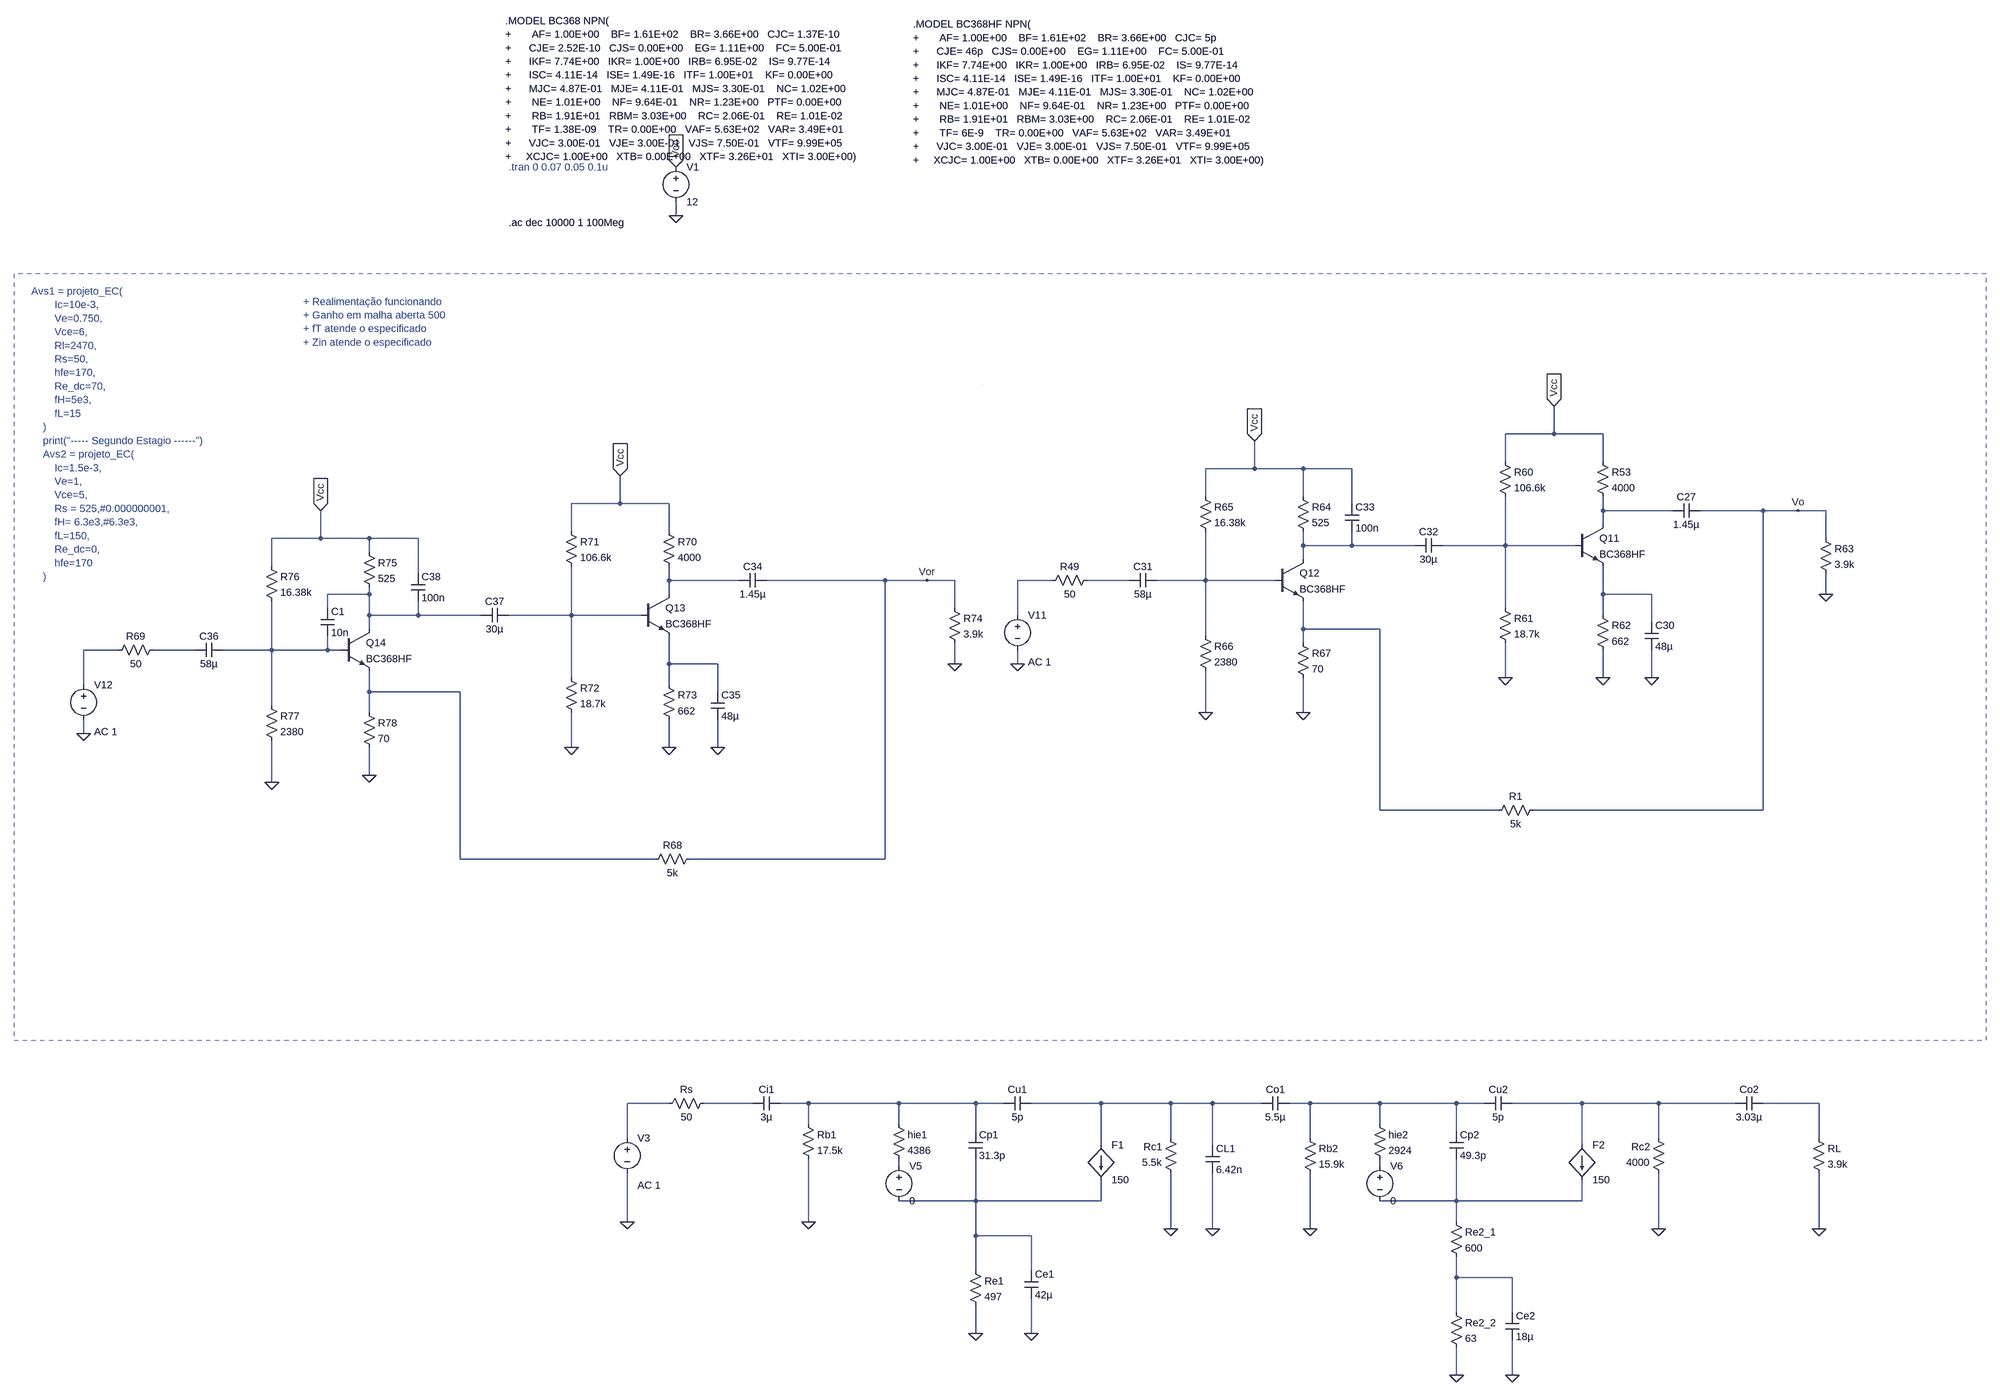
[diagram p0: schematic Simulacao.asc]
Simulacao.asc, the LTspice schematic file:
Version 4.1
SHEET 1 6724 3060
WIRE -704 -704 -704 -736
WIRE 1312 112 1312 48
WIRE 1312 112 1200 112
WIRE 1424 112 1312 112
WIRE 1200 176 1200 112
WIRE 1424 176 1424 112
WIRE 624 192 624 128
WIRE 624 192 512 192
WIRE 736 192 624 192
WIRE 848 192 736 192
WIRE 512 256 512 192
WIRE 736 256 736 192
WIRE -832 272 -832 208
WIRE -832 272 -944 272
WIRE -720 272 -832 272
WIRE 848 272 848 192
WIRE 1424 288 1424 256
WIRE 1584 288 1424 288
WIRE 1792 288 1648 288
WIRE 1872 288 1792 288
WIRE 1936 288 1872 288
WIRE 1424 320 1424 288
WIRE -944 336 -944 272
WIRE -720 336 -720 272
WIRE -1520 352 -1520 288
WIRE -1520 352 -1632 352
WIRE -1408 352 -1520 352
WIRE -1296 352 -1408 352
WIRE 1936 352 1936 288
WIRE 736 368 736 336
WIRE 848 368 848 336
WIRE 848 368 736 368
WIRE 992 368 848 368
WIRE 1200 368 1200 256
WIRE 1200 368 1056 368
WIRE 1360 368 1200 368
WIRE -1408 384 -1408 352
WIRE 736 400 736 368
WIRE -1632 416 -1632 352
WIRE -1296 432 -1296 352
WIRE -720 448 -720 416
WIRE -560 448 -720 448
WIRE -224 448 -496 448
WIRE -128 448 -224 448
WIRE -64 448 -128 448
WIRE 160 448 80 448
WIRE 336 448 240 448
WIRE 512 448 512 336
WIRE 512 448 400 448
WIRE 672 448 512 448
WIRE -1408 480 -1408 464
WIRE -1408 480 -1504 480
WIRE -720 480 -720 448
WIRE 1424 480 1424 416
WIRE 1536 480 1424 480
WIRE 1936 480 1936 432
WIRE -1504 512 -1504 480
WIRE -64 512 -64 448
WIRE 1200 512 1200 368
WIRE -1408 528 -1408 480
WIRE -1296 528 -1296 496
WIRE -1296 528 -1408 528
WIRE -1152 528 -1296 528
WIRE -944 528 -944 416
WIRE -944 528 -1088 528
WIRE -784 528 -944 528
WIRE 80 528 80 448
WIRE 1424 528 1424 480
WIRE 1536 544 1536 480
WIRE -1408 560 -1408 528
WIRE 736 560 736 496
WIRE 912 560 736 560
WIRE 512 576 512 448
WIRE 736 592 736 560
WIRE -1984 608 -2064 608
WIRE -1808 608 -1904 608
WIRE -1632 608 -1632 496
WIRE -1632 608 -1744 608
WIRE -1504 608 -1504 576
WIRE -1504 608 -1632 608
WIRE -1472 608 -1504 608
WIRE -720 640 -720 576
WIRE -608 640 -720 640
WIRE -64 640 -64 592
WIRE 80 640 80 608
WIRE -944 672 -944 528
WIRE 1200 672 1200 592
WIRE 1424 672 1424 608
WIRE 1536 672 1536 608
WIRE -2064 688 -2064 608
WIRE -720 688 -720 640
WIRE -1408 704 -1408 656
WIRE -1200 704 -1408 704
WIRE -608 704 -608 640
WIRE -1632 736 -1632 608
WIRE -1408 752 -1408 704
WIRE 512 752 512 656
WIRE 736 752 736 672
WIRE -2064 800 -2064 768
WIRE -944 832 -944 752
WIRE -720 832 -720 768
WIRE -608 832 -608 768
WIRE -1408 896 -1408 832
WIRE -1632 912 -1632 816
WIRE 912 976 912 560
WIRE 1184 976 912 976
WIRE 1792 976 1792 288
WIRE 1792 976 1264 976
WIRE -1200 1088 -1200 704
WIRE -752 1088 -1200 1088
WIRE -224 1088 -224 448
WIRE -224 1088 -672 1088
WIRE -720 2416 -816 2416
WIRE -528 2416 -640 2416
WIRE -400 2416 -464 2416
WIRE -192 2416 -400 2416
WIRE -16 2416 -192 2416
WIRE 48 2416 -16 2416
WIRE 272 2416 112 2416
WIRE 432 2416 272 2416
WIRE 528 2416 432 2416
WIRE 640 2416 528 2416
WIRE 752 2416 704 2416
WIRE 912 2416 752 2416
WIRE 1088 2416 912 2416
WIRE 1152 2416 1088 2416
WIRE 1376 2416 1216 2416
WIRE 1552 2416 1376 2416
WIRE 1728 2416 1552 2416
WIRE 1920 2416 1792 2416
WIRE -400 2464 -400 2416
WIRE -192 2464 -192 2416
WIRE 912 2464 912 2416
WIRE -16 2480 -16 2416
WIRE 1088 2480 1088 2416
WIRE -816 2496 -816 2416
WIRE 432 2496 432 2416
WIRE 752 2496 752 2416
WIRE 1552 2496 1552 2416
WIRE 1920 2496 1920 2416
WIRE 272 2512 272 2416
WIRE 528 2512 528 2416
WIRE 1376 2512 1376 2416
WIRE -192 2560 -192 2544
WIRE 912 2560 912 2544
WIRE -16 2640 -16 2544
WIRE -16 2640 -192 2640
WIRE 272 2640 272 2592
WIRE 272 2640 -16 2640
WIRE 1088 2640 1088 2544
WIRE 1088 2640 912 2640
WIRE 1376 2640 1376 2592
WIRE 1376 2640 1088 2640
WIRE -816 2688 -816 2576
WIRE -400 2688 -400 2544
WIRE 1088 2688 1088 2640
WIRE 432 2704 432 2576
WIRE 528 2704 528 2576
WIRE 752 2704 752 2576
WIRE 1552 2704 1552 2576
WIRE 1920 2704 1920 2576
WIRE -16 2720 -16 2640
WIRE 112 2720 -16 2720
WIRE -16 2800 -16 2720
WIRE 112 2800 112 2720
WIRE 1088 2816 1088 2768
WIRE 1216 2816 1088 2816
WIRE 1088 2896 1088 2816
WIRE 1216 2896 1216 2816
WIRE -16 2944 -16 2880
WIRE 112 2944 112 2864
WIRE 1088 3040 1088 2976
WIRE 1216 3040 1216 2960
WIRE 0 0 0 0
FLAG -704 -704 0
FLAG -704 -816 Vcc
IOPIN -704 -816 In
FLAG -816 2688 0
FLAG -400 2688 0
FLAG -16 2944 0
FLAG 112 2944 0
FLAG 432 2704 0
FLAG 752 2704 0
FLAG 1088 3040 0
FLAG 1216 3040 0
FLAG 1552 2704 0
FLAG 1920 2704 0
FLAG 528 2704 0
FLAG 80 640 0
FLAG 1424 672 0
FLAG 1200 672 0
FLAG 1312 48 Vcc
IOPIN 1312 48 In
FLAG 1936 480 0
FLAG 1536 672 0
FLAG 1872 288 Vo
FLAG 512 752 0
FLAG 624 128 Vcc
IOPIN 624 128 In
FLAG 736 752 0
FLAG -2064 800 0
FLAG -720 832 0
FLAG -944 832 0
FLAG -832 208 Vcc
IOPIN -832 208 In
FLAG -64 640 0
FLAG -608 832 0
FLAG -128 448 Vor
FLAG -1632 912 0
FLAG -1520 288 Vcc
IOPIN -1520 288 In
FLAG -1408 896 0
SYMBOL voltage -704 -832 R0
SYMATTR InstName V1
SYMATTR Value 12
SYMBOL res -208 2448 R0
SYMATTR InstName hie1
SYMATTR Value 4386
SYMBOL cap -32 2480 R0
SYMATTR InstName Cp1
SYMATTR Value 31.3p
SYMBOL cap 112 2400 R90
WINDOW 0 0 32 VBottom 2
WINDOW 3 32 32 VTop 2
SYMATTR InstName Cu1
SYMATTR Value 5p
SYMBOL res -416 2448 R0
SYMATTR InstName Rb1
SYMATTR Value 17.5k
SYMBOL res -624 2400 R90
WINDOW 0 0 56 VBottom 2
WINDOW 3 32 56 VTop 2
SYMATTR InstName Rs
SYMATTR Value 50
SYMBOL voltage -816 2480 R0
WINDOW 123 24 124 Left 2
WINDOW 39 0 0 Left 0
SYMATTR Value2 AC 1
SYMATTR InstName V3
SYMATTR Value ""
SYMBOL res -32 2784 R0
SYMATTR InstName Re1
SYMATTR Value 497
SYMBOL cap 96 2800 R0
SYMATTR InstName Ce1
SYMATTR Value 42µ
SYMBOL res 448 2592 R180
WINDOW 0 36 76 Left 2
WINDOW 3 36 40 Left 2
SYMATTR InstName Rc1
SYMATTR Value 5.5k
SYMBOL res 736 2480 R0
SYMATTR InstName Rb2
SYMATTR Value 15.9k
SYMBOL res 896 2448 R0
SYMATTR InstName hie2
SYMATTR Value 2924
SYMBOL cap 1072 2480 R0
SYMATTR InstName Cp2
SYMATTR Value 49.3p
SYMBOL cap 1216 2400 R90
WINDOW 0 0 32 VBottom 2
WINDOW 3 32 32 VTop 2
SYMATTR InstName Cu2
SYMATTR Value 5p
SYMBOL res 1072 2880 R0
SYMATTR InstName Re2_2
SYMATTR Value 63
SYMBOL cap 1200 2896 R0
SYMATTR InstName Ce2
SYMATTR Value 18µ
SYMBOL res 1568 2592 R180
WINDOW 0 36 76 Left 2
WINDOW 3 36 40 Left 2
SYMATTR InstName Rc2
SYMATTR Value 4000
SYMBOL res 1904 2480 R0
SYMATTR InstName RL
SYMATTR Value 3.9k
SYMBOL cap -464 2400 R90
WINDOW 0 0 32 VBottom 2
WINDOW 3 32 32 VTop 2
SYMATTR InstName Ci1
SYMATTR Value 3µ
SYMBOL cap 704 2400 R90
WINDOW 0 0 32 VBottom 2
WINDOW 3 32 32 VTop 2
SYMATTR InstName Co1
SYMATTR Value 5.5µ
SYMBOL cap 1792 2400 R90
WINDOW 0 0 32 VBottom 2
WINDOW 3 32 32 VTop 2
SYMATTR InstName Co2
SYMATTR Value 3.03µ
SYMBOL cap 512 2512 R0
SYMATTR InstName CL1
SYMATTR Value 6.42n
SYMBOL res 1072 2672 R0
SYMATTR InstName Re2_1
SYMATTR Value 600
SYMBOL voltage -192 2544 R0
SYMATTR InstName V5
SYMATTR Value 0
SYMBOL voltage 912 2544 R0
SYMATTR InstName V6
SYMATTR Value 0
SYMBOL f 272 2512 R0
SYMATTR InstName F1
SYMATTR Value 150
SYMATTR SpiceModel V5
SYMBOL f 1376 2512 R0
SYMATTR InstName F2
SYMATTR Value 150
SYMATTR SpiceModel V6
SYMBOL res 256 432 R90
WINDOW 0 0 56 VBottom 2
WINDOW 3 32 56 VTop 2
SYMATTR InstName R49
SYMATTR Value 50
SYMBOL voltage 80 512 R0
WINDOW 123 24 124 Left 2
WINDOW 39 0 0 Left 0
SYMATTR Value2 AC 1
SYMATTR InstName V11
SYMATTR Value ""
SYMBOL npn 1360 320 R0
SYMATTR InstName Q11
SYMATTR Value BC368HF
SYMBOL res 1408 160 R0
SYMATTR InstName R53
SYMATTR Value 4000
SYMBOL res 1184 160 R0
SYMATTR InstName R60
SYMATTR Value 106.6k
SYMBOL res 1184 496 R0
SYMATTR InstName R61
SYMATTR Value 18.7k
SYMBOL res 1408 512 R0
SYMATTR InstName R62
SYMATTR Value 662
SYMBOL res 1920 336 R0
SYMATTR InstName R63
SYMATTR Value 3.9k
SYMBOL cap 1648 272 R90
WINDOW 0 0 32 VBottom 2
WINDOW 3 32 32 VTop 2
SYMATTR InstName C27
SYMATTR Value 1.45µ
SYMBOL cap 1520 544 R0
SYMATTR InstName C30
SYMATTR Value 48µ
SYMBOL npn 672 400 R0
SYMATTR InstName Q12
SYMATTR Value BC368HF
SYMBOL res 720 240 R0
SYMATTR InstName R64
SYMATTR Value 525
SYMBOL res 496 240 R0
SYMATTR InstName R65
SYMATTR Value 16.38k
SYMBOL res 496 560 R0
SYMATTR InstName R66
SYMATTR Value 2380
SYMBOL cap 400 432 R90
WINDOW 0 0 32 VBottom 2
WINDOW 3 32 32 VTop 2
SYMATTR InstName C31
SYMATTR Value 58µ
SYMBOL cap 1056 352 R90
WINDOW 0 0 32 VBottom 2
WINDOW 3 32 32 VTop 2
SYMATTR InstName C32
SYMATTR Value 30µ
SYMBOL cap 832 272 R0
SYMATTR InstName C33
SYMATTR Value 100n
SYMBOL res 720 576 R0
SYMATTR InstName R67
SYMATTR Value 70
SYMBOL res -656 1072 R90
WINDOW 0 0 56 VBottom 2
WINDOW 3 32 56 VTop 2
SYMATTR InstName R68
SYMATTR Value 5k
SYMBOL res -1888 592 R90
WINDOW 0 0 56 VBottom 2
WINDOW 3 32 56 VTop 2
SYMATTR InstName R69
SYMATTR Value 50
SYMBOL voltage -2064 672 R0
WINDOW 123 24 124 Left 2
WINDOW 39 0 0 Left 0
SYMATTR Value2 AC 1
SYMATTR InstName V12
SYMATTR Value ""
SYMBOL npn -784 480 R0
SYMATTR InstName Q13
SYMATTR Value BC368HF
SYMBOL res -736 320 R0
SYMATTR InstName R70
SYMATTR Value 4000
SYMBOL res -960 320 R0
SYMATTR InstName R71
SYMATTR Value 106.6k
SYMBOL res -960 656 R0
SYMATTR InstName R72
SYMATTR Value 18.7k
SYMBOL res -736 672 R0
SYMATTR InstName R73
SYMATTR Value 662
SYMBOL res -80 496 R0
SYMATTR InstName R74
SYMATTR Value 3.9k
SYMBOL cap -496 432 R90
WINDOW 0 0 32 VBottom 2
WINDOW 3 32 32 VTop 2
SYMATTR InstName C34
SYMATTR Value 1.45µ
SYMBOL cap -624 704 R0
SYMATTR InstName C35
SYMATTR Value 48µ
SYMBOL npn -1472 560 R0
SYMATTR InstName Q14
SYMATTR Value BC368HF
SYMBOL res -1424 368 R0
SYMATTR InstName R75
SYMATTR Value 525
SYMBOL res -1648 400 R0
SYMATTR InstName R76
SYMATTR Value 16.38k
SYMBOL res -1648 720 R0
SYMATTR InstName R77
SYMATTR Value 2380
SYMBOL cap -1744 592 R90
WINDOW 0 0 32 VBottom 2
WINDOW 3 32 32 VTop 2
SYMATTR InstName C36
SYMATTR Value 58µ
SYMBOL cap -1088 512 R90
WINDOW 0 0 32 VBottom 2
WINDOW 3 32 32 VTop 2
SYMATTR InstName C37
SYMATTR Value 30µ
SYMBOL cap -1312 432 R0
SYMATTR InstName C38
SYMATTR Value 100n
SYMBOL res -1424 736 R0
SYMATTR InstName R78
SYMATTR Value 70
SYMBOL res 1280 960 R90
WINDOW 0 0 56 VBottom 2
WINDOW 3 32 56 VTop 2
SYMATTR InstName R1
SYMATTR Value 5k
SYMBOL cap -1520 512 R0
SYMATTR InstName C1
SYMATTR Value 10n
TEXT -1096 -1152 Left 2 !.MODEL BC368 NPN(\n+       AF= 1.00E+00    BF= 1.61E+02    BR= 3.66E+00   CJC= 1.37E-10\n+      CJE= 2.52E-10   CJS= 0.00E+00    EG= 1.11E+00    FC= 5.00E-01\n+      IKF= 7.74E+00   IKR= 1.00E+00   IRB= 6.95E-02    IS= 9.77E-14\n+      ISC= 4.11E-14   ISE= 1.49E-16   ITF= 1.00E+01    KF= 0.00E+00\n+      MJC= 4.87E-01   MJE= 4.11E-01   MJS= 3.30E-01    NC= 1.02E+00\n+       NE= 1.01E+00    NF= 9.64E-01    NR= 1.23E+00   PTF= 0.00E+00\n+       RB= 1.91E+01   RBM= 3.03E+00    RC= 2.06E-01    RE= 1.01E-02\n+       TF= 1.38E-09    TR= 0.00E+00   VAF= 5.63E+02   VAR= 3.49E+01\n+      VJC= 3.00E-01   VJE= 3.00E-01   VJS= 7.50E-01   VTF= 9.99E+05\n+     XCJC= 1.00E+00   XTB= 0.00E+00   XTF= 3.26E+01   XTI= 3.00E+00)
TEXT -1088 -816 Left 2 ;.tran 0 0.07 0.05 0.1u
TEXT -160 -1144 Left 2 !.MODEL BC368HF NPN(\n+       AF= 1.00E+00    BF= 1.61E+02    BR= 3.66E+00   CJC= 5p\n+      CJE= 46p   CJS= 0.00E+00    EG= 1.11E+00    FC= 5.00E-01\n+      IKF= 7.74E+00   IKR= 1.00E+00   IRB= 6.95E-02    IS= 9.77E-14\n+      ISC= 4.11E-14   ISE= 1.49E-16   ITF= 1.00E+01    KF= 0.00E+00\n+      MJC= 4.87E-01   MJE= 4.11E-01   MJS= 3.30E-01    NC= 1.02E+00\n+       NE= 1.01E+00    NF= 9.64E-01    NR= 1.23E+00   PTF= 0.00E+00\n+       RB= 1.91E+01   RBM= 3.03E+00    RC= 2.06E-01    RE= 1.01E-02\n+       TF= 6E-9    TR= 0.00E+00   VAF= 5.63E+02   VAR= 3.49E+01\n+      VJC= 3.00E-01   VJE= 3.00E-01   VJS= 7.50E-01   VTF= 9.99E+05\n+     XCJC= 1.00E+00   XTB= 0.00E+00   XTF= 3.26E+01   XTI= 3.00E+00)
TEXT -1088 -688 Left 2 !.ac dec 10000 1 100Meg
TEXT -2184 -216 Left 2 ;Avs1 = projeto_EC(\n        Ic=10e-3,\n        Ve=0.750,\n        Vce=6,\n        Rl=2470,\n        Rs=50,\n        hfe=170,\n        Re_dc=70,\n        fH=5e3,\n        fL=15\n    )\n    print("----- Segundo Estagio ------")\n    Avs2 = projeto_EC(\n        Ic=1.5e-3,\n        Ve=1,\n        Vce=5,\n        Rs = 525,#0.000000001,\n        fH= 6.3e3,#6.3e3,\n        fL=150,\n        Re_dc=0,\n        hfe=170\n    )
TEXT -1560 -192 Left 2 ;+ Realimentação funcionando\n+ Ganho em malha aberta 500\n+ fT atende o especificado\n+ Zin atende o especificado
RECTANGLE Normal -2224 1504 2304 -256 2

The netlist it stands for:
* Simulacao.asc
V1 Vcc 0 12
R§hie1 N019 N024 4386
Cp1 N019 N026 31.3p
Cu1 N020 N019 5p
Rb1 N019 0 17.5k
Rs N018 N017 50
V3 N017 0 AC 1
Re1 N026 0 497
Ce1 N026 0 42µ
Rc1 0 N020 5.5k
Rb2 N021 0 15.9k
R§hie2 N021 N025 2924
Cp2 N021 N027 49.3p
Cu2 N022 N021 5p
Re2_2 N028 0 63
Ce2 N028 0 18µ
Rc2 0 N022 4000
RL N023 0 3.9k
Ci1 N019 N018 3µ
Co1 N021 N020 5.5µ
Co2 N023 N022 3.03µ
CL1 N020 0 6.42n
Re2_1 N027 N028 600
V5 N024 N026 0
V6 N025 N027 0
F1 N020 N026 V5 150
F2 N022 N027 V6 150
R49 N006 N005 50
V11 N005 0 AC 1
Q11 N001 N003 N009 0 BC368HF
R53 Vcc N001 4000
R60 Vcc N003 106.6k
R61 N003 0 18.7k
R62 N009 0 662
R63 Vo 0 3.9k
C27 Vo N001 1.45µ
C30 N009 0 48µ
Q12 N002 N007 N011 0 BC368HF
R64 Vcc N002 525
R65 Vcc N007 16.38k
R66 N007 0 2380
C31 N007 N006 58µ
C32 N003 N002 30µ
C33 Vcc N002 100n
R67 N011 0 70
R68 Vor N016 5k
R69 N013 N012 50
V12 N012 0 AC 1
Q13 N004 N010 N015 0 BC368HF
R70 Vcc N004 4000
R71 Vcc N010 106.6k
R72 N010 0 18.7k
R73 N015 0 662
R74 Vor 0 3.9k
C34 Vor N004 1.45µ
C35 N015 0 48µ
Q14 N008 N014 N016 0 BC368HF
R75 Vcc N008 525
R76 Vcc N014 16.38k
R77 N014 0 2380
C36 N014 N013 58µ
C37 N010 N008 30µ
C38 Vcc N008 100n
R78 N016 0 70
R1 Vo N011 5k
C1 N008 N014 10n
.model NPN NPN
.model PNP PNP
.lib standard.bjt
.MODEL BC368 NPN(
+       AF= 1.00E+00    BF= 1.61E+02    BR= 3.66E+00   CJC= 1.37E-10
+      CJE= 2.52E-10   CJS= 0.00E+00    EG= 1.11E+00    FC= 5.00E-01
+      IKF= 7.74E+00   IKR= 1.00E+00   IRB= 6.95E-02    IS= 9.77E-14
+      ISC= 4.11E-14   ISE= 1.49E-16   ITF= 1.00E+01    KF= 0.00E+00
+      MJC= 4.87E-01   MJE= 4.11E-01   MJS= 3.30E-01    NC= 1.02E+00
+       NE= 1.01E+00    NF= 9.64E-01    NR= 1.23E+00   PTF= 0.00E+00
+       RB= 1.91E+01   RBM= 3.03E+00    RC= 2.06E-01    RE= 1.01E-02
+       TF= 1.38E-09    TR= 0.00E+00   VAF= 5.63E+02   VAR= 3.49E+01
+      VJC= 3.00E-01   VJE= 3.00E-01   VJS= 7.50E-01   VTF= 9.99E+05
+     XCJC= 1.00E+00   XTB= 0.00E+00   XTF= 3.26E+01   XTI= 3.00E+00)
* .tran 0 0.07 0.05 0.1u
.MODEL BC368HF NPN(
+       AF= 1.00E+00    BF= 1.61E+02    BR= 3.66E+00   CJC= 5p
+      CJE= 46p   CJS= 0.00E+00    EG= 1.11E+00    FC= 5.00E-01
+      IKF= 7.74E+00   IKR= 1.00E+00   IRB= 6.95E-02    IS= 9.77E-14
+      ISC= 4.11E-14   ISE= 1.49E-16   ITF= 1.00E+01    KF= 0.00E+00
+      MJC= 4.87E-01   MJE= 4.11E-01   MJS= 3.30E-01    NC= 1.02E+00
+       NE= 1.01E+00    NF= 9.64E-01    NR= 1.23E+00   PTF= 0.00E+00
+       RB= 1.91E+01   RBM= 3.03E+00    RC= 2.06E-01    RE= 1.01E-02
+       TF= 6E-9    TR= 0.00E+00   VAF= 5.63E+02   VAR= 3.49E+01
+      VJC= 3.00E-01   VJE= 3.00E-01   VJS= 7.50E-01   VTF= 9.99E+05
+     XCJC= 1.00E+00   XTB= 0.00E+00   XTF= 3.26E+01   XTI= 3.00E+00)
.ac dec 10000 1 100Meg
* Avs1 = projeto_EC(
*         Ic=10e-3,
*         Ve=0.750,
*         Vce=6,
*         Rl=2470,
*         Rs=50,
*         hfe=170,
*         Re_dc=70,
*         fH=5e3,
*         fL=15
*     )
*     print("----- Segundo Estagio ------")
*     Avs2 = projeto_EC(
*         Ic=1.5e-3,
*         Ve=1,
*         Vce=5,
*         Rs = 525,#0.000000001,
*         fH= 6.3e3,#6.3e3,
*         fL=150,
*         Re_dc=0,
*         hfe=170
*     )
* + Realimentação funcionando
* + Ganho em malha aberta 500
* + fT atende o especificado
* + Zin atende o especificado
.backanno
.end